# EAGLE schematic Control_Board (EAGLE 9.1.2)

## Sheet 1 of 2
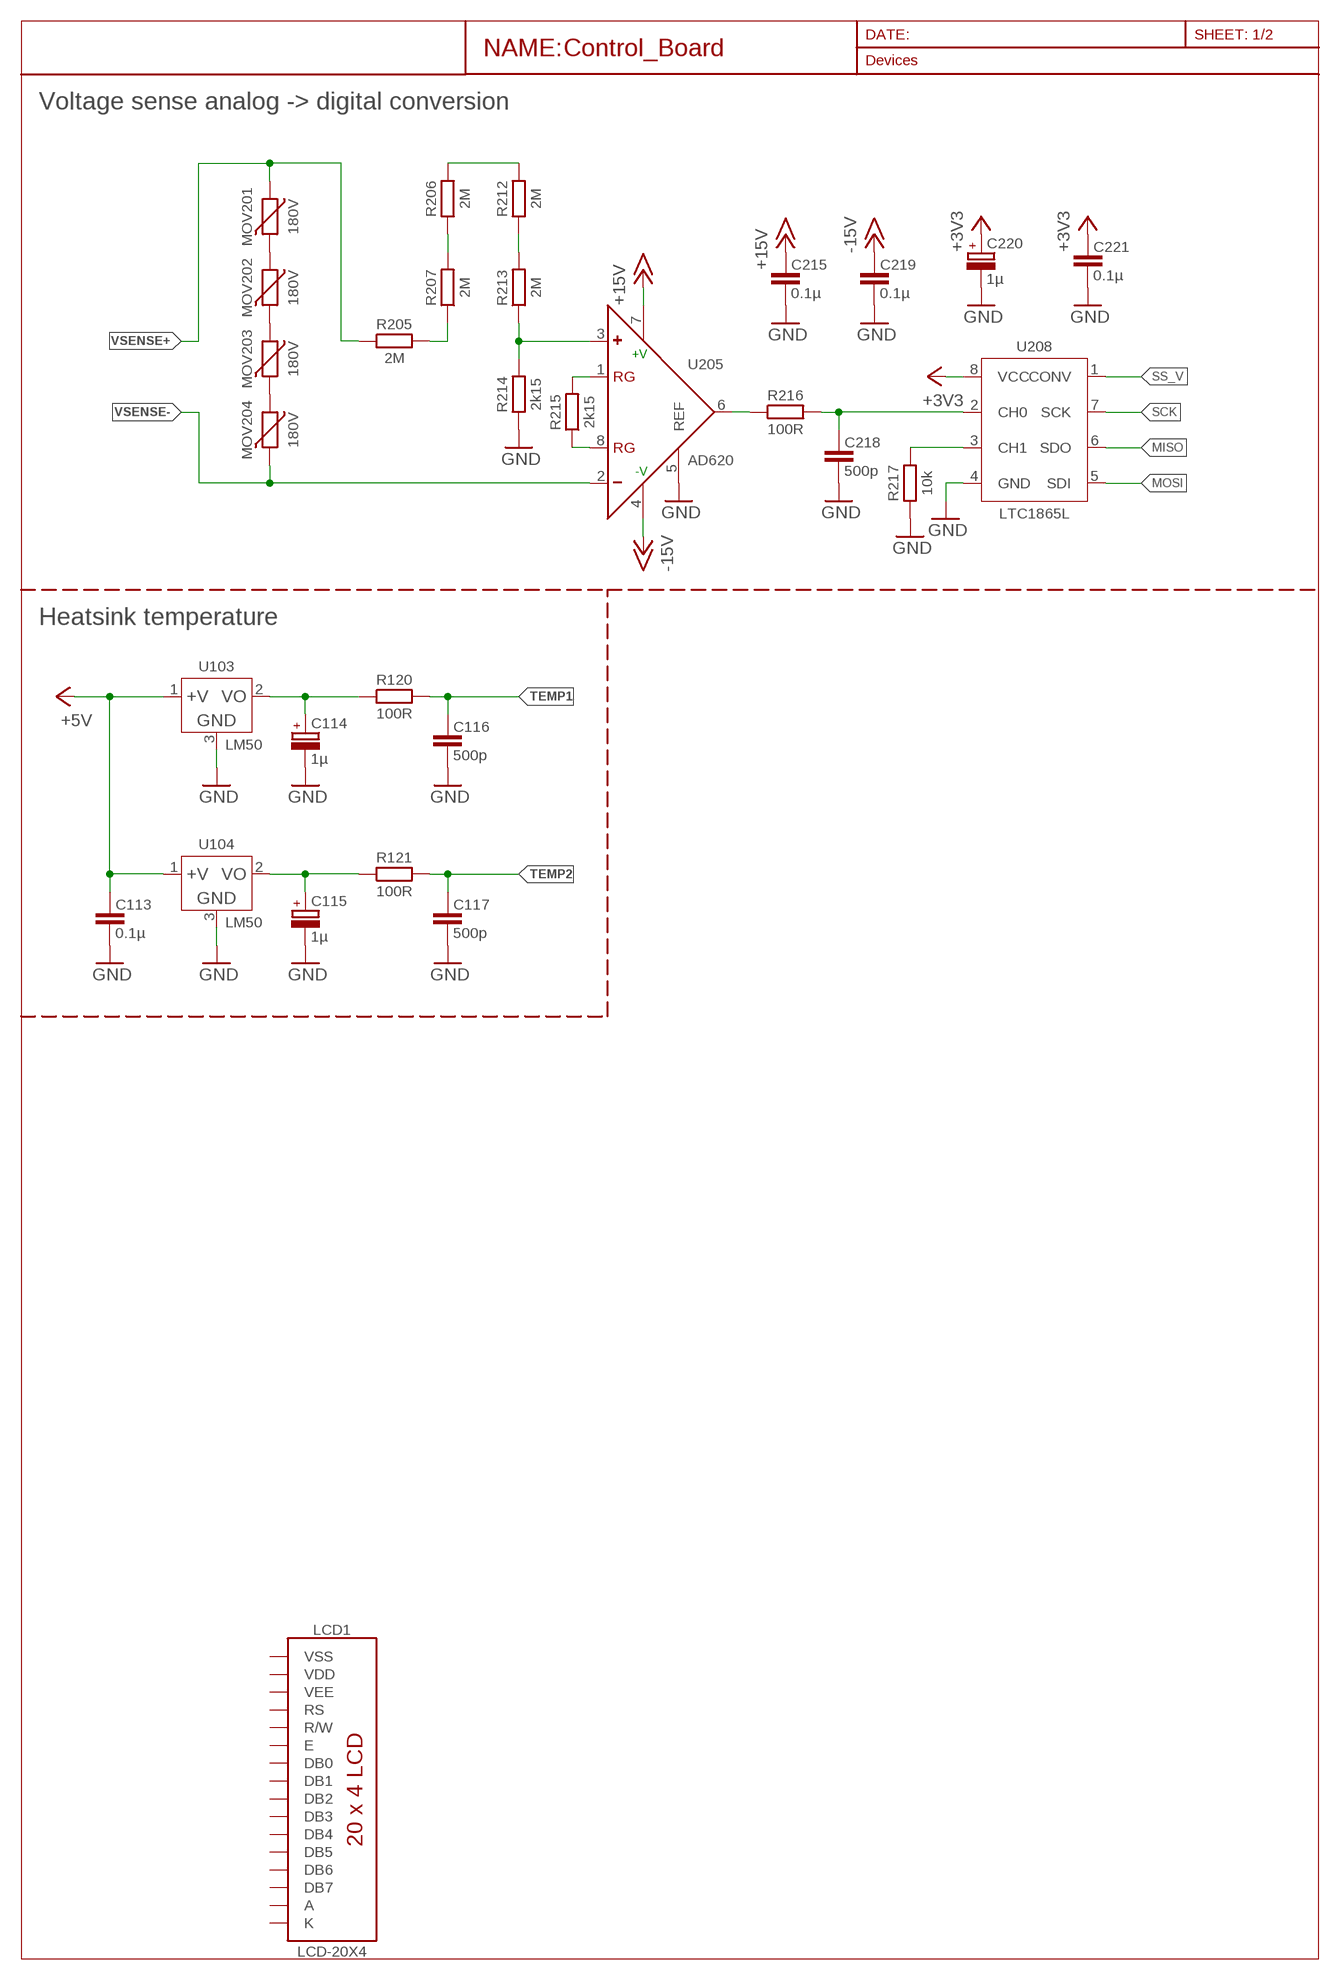
[diagram p0: schematic, sheet 1]

### Parts
C113  0.1µ  C-EU-3216  [C3216]
C114  1µ  CPOL-3216-A  [CT3216]
C115  1µ  CPOL-3216-A  [CT3216]
C116  500p  C-EU-1608  [C1608]
C117  500p  C-EU-1608  [C1608]
C215  0.1µ  C-EU-3216  [C3216]
C218  500p  C-EU-1608  [C1608]
C219  0.1µ  C-EU-3216  [C3216]
C220  1µ  CPOL-3216-A  [CT3216]
C221  0.1µ  C-EU-3216  [C3216]
LCD1  LCD-20X4  [4X20_LED]
MOV201  180V  MOV-3225  [R3225W]
MOV202  180V  MOV-3225  [R3225W]
MOV203  180V  MOV-3225  [R3225W]
MOV204  180V  MOV-3225  [R3225W]
R120  100R  R-EU-2012  [R2012W]
R121  100R  R-EU-2012  [R2012W]
R205  2M  R-EU-3216  [R3216W]
R206  2M  R-EU-3216  [R3216W]
R207  2M  R-EU-3216  [R3216W]
R212  2M  R-EU-3216  [R3216W]
R213  2M  R-EU-3216  [R3216W]
R214  2k15  R-EU-2012  [R2012W]
R215  2k15  R-EU-2012  [R2012W]
R216  100R  R-EU-2012  [R2012W]
R217  10k  R-EU-1608  [R1608]
U103  LM50  [SOT23W]
U104  LM50  [SOT23W]
U205  AD620  AD620R-8  [SO8]
U208  LTC1865L  [SO8]

### Nets
+3V3: C220.+ C221.1 U208.8(VCC) ; also sheet 2
+5V: C113.1 U103.1(+V) U104.1(+V) ; also sheet 2
+15V: C215.1 U205.7(+V) ; also sheet 2
-15V: C219.1 U205.4(-V) ; also sheet 2
GND: C113.2 C114.- C115.- C116.2 C117.2 C215.2 C218.2 C219.2 C220.- C221.2 R214.1 R217.1 U103.3(GND) U104.3(GND) U205.5(REF) U208.4(GND) ; also sheet 2
MISO: U208.6(SDO)
MOSI: U208.5(SDI)
N$1: MOV201.2 MOV202.1
N$2: MOV202.2 MOV203.1
N$25: R212.1 R213.2
N$26: R206.2 R212.2
N$27: R206.1 R207.2
N$28: R205.2 R207.1
N$29: R213.1 R214.2 U205.3(+)
N$30: C218.1 R216.2 U208.2(CH0)
N$31: R216.1 U205.6(OUT)
N$36: MOV203.2 MOV204.1
N$45: R217.2 U208.3(CH1)
RG1_H6: R215.2 U205.1(RG)
RG2_H6: R215.1 U205.8(RG)
SCK: U208.7(SCK)
SS_V: U208.1(CONV)
T1_OUT: C114.+ R120.1 U103.2(VO)
T2_OUT: C115.+ R121.1 U104.2(VO)
TEMP1: C116.1 R120.2
TEMP2: C117.1 R121.2
VSENSE+: MOV201.1 R205.1
VSENSE-: MOV204.2 U205.2(-)
Unconnected: LCD1.4(RS) LCD1.5(R/W) LCD1.6(E) LCD1.7(DB0) LCD1.8(DB1) LCD1.9(DB2) LCD1.10(DB3) LCD1.11(DB4) LCD1.12(DB5) LCD1.13(DB6) LCD1.14(DB7)

### Notes on the sheet
- Voltage sense analog -> digital conversion
- Heatsink temperature

## Sheet 2 of 2
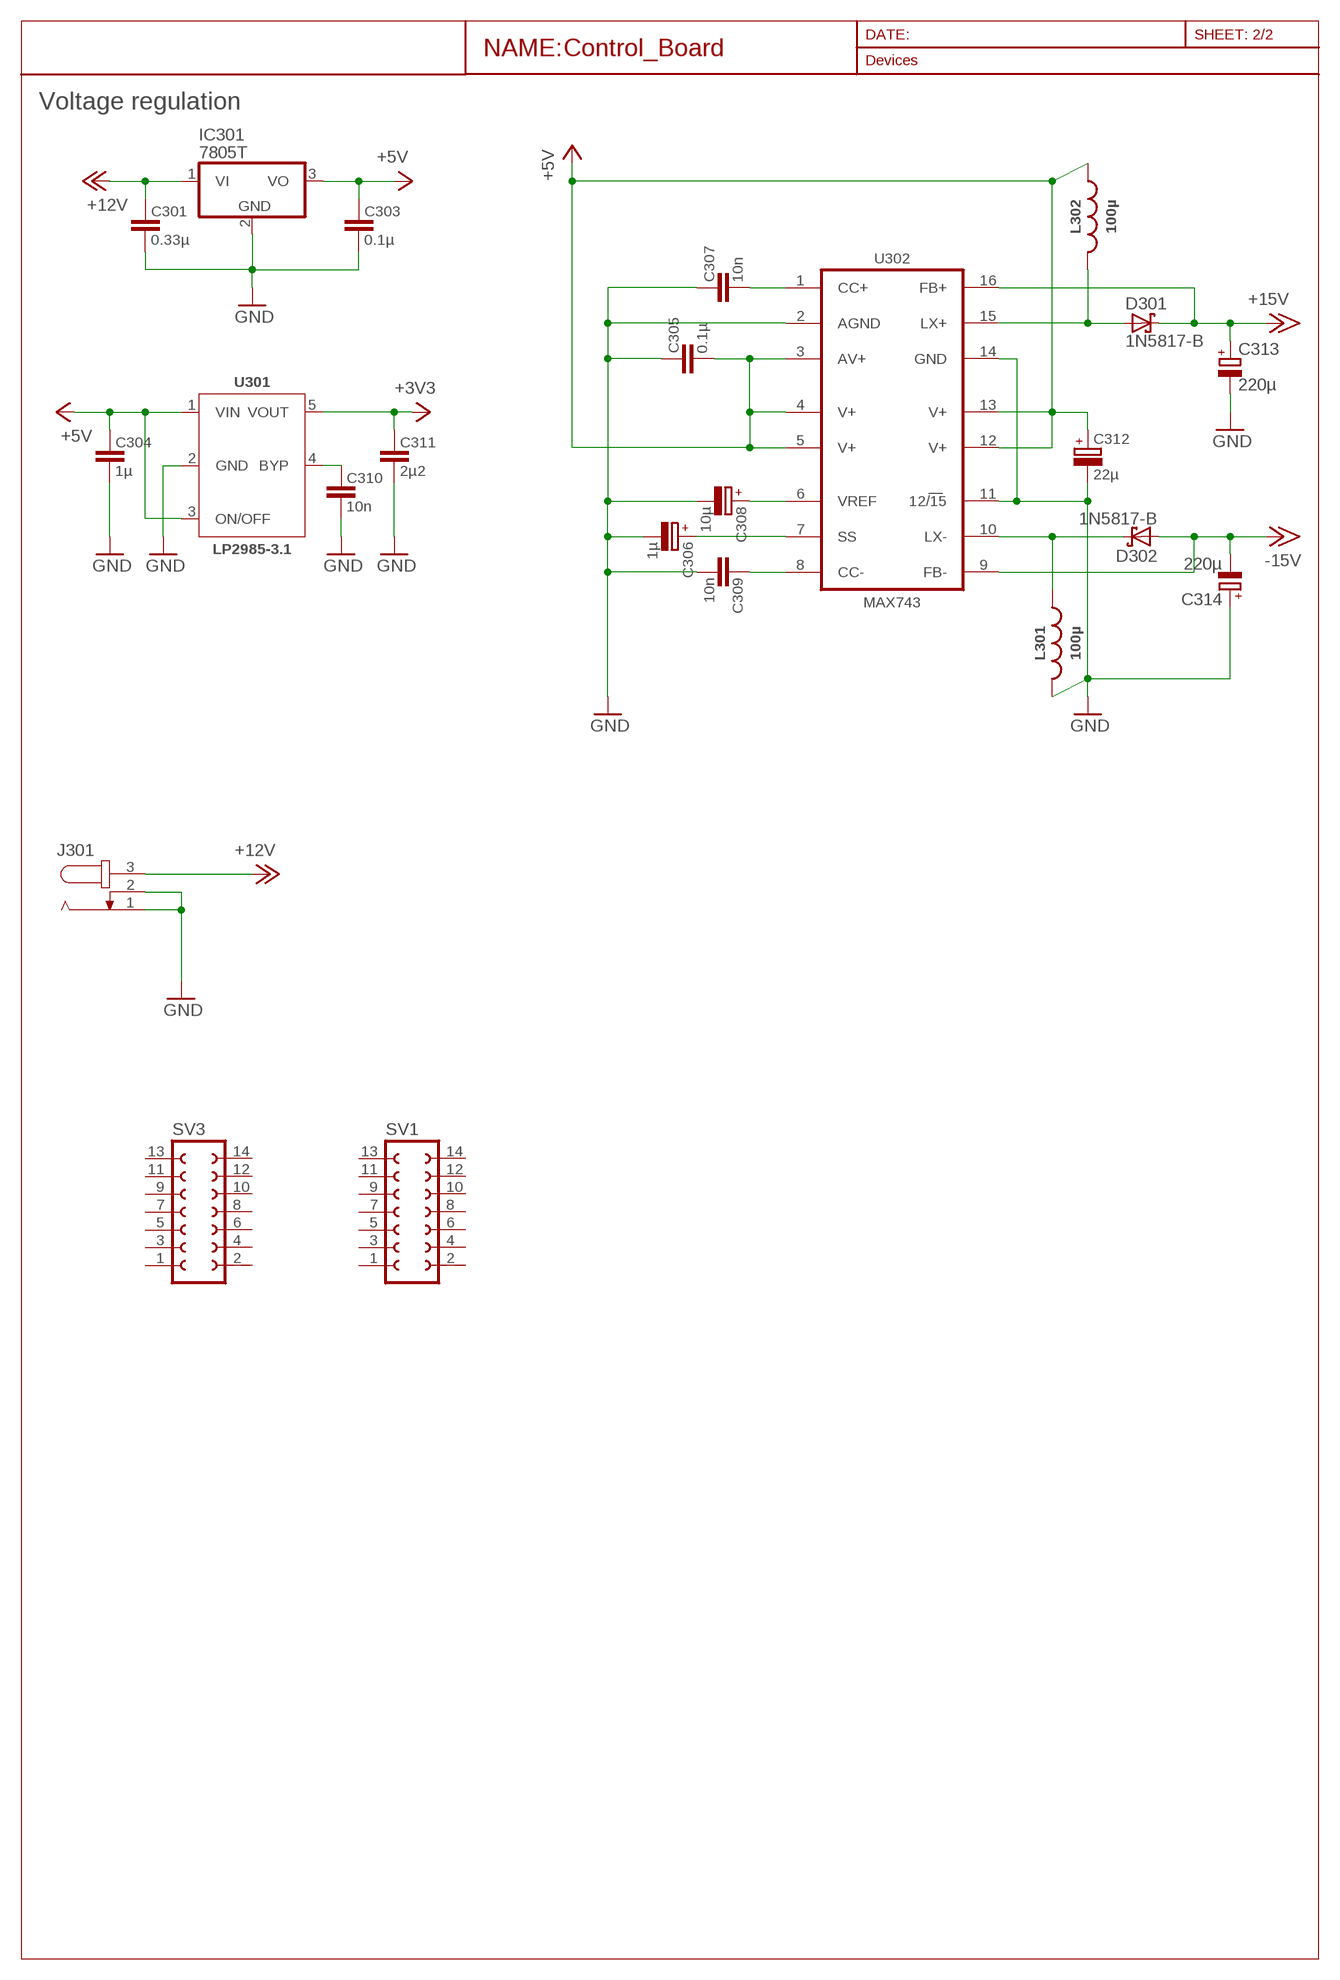
[diagram p1: schematic, sheet 2]

### Parts
C301  0.33µ  C-EU-3216  [C3216]
C303  0.1µ  C-EU-3216  [C3216]
C304  1µ  C-EU-3216  [C3216]
C305  0.1µ  C-EU-3216  [C3216]
C306  1µ  CPOL-3216-A  [CT3216]
C307  10n  C-EU-3216  [C3216]
C308  10µ  CPOL-6032-C  [CT6032]
C309  10n  C-EU-3216  [C3216]
C310  10n  C-EU-3216  [C3216]
C311  2µ2  C-EU-3216  [C3216]
C312  22µ  CPOL-6032-C  [CT6032]
C313  220µ  CPOL-EUE3.5-10  [E3,5-10]
C314  220µ  CPOL-EUE3.5-10  [E3,5-10]
D301  1N5817-B  [DO41-7.6]
D302  1N5817-B  [DO41-7.6]
IC301  7805T  [TO220H]
J301  JACK-PLUG0  [SPC4077]
L301  100µ  L-EUSRN1060  [SRN1060]
L302  100µ  L-EUSRN1060  [SRN1060]
SV1  FE07-2W  [FE07-2W]
SV3  FE07-2W  [FE07-2W]
U301  LP2985-3.1  [SOT23-5L]
U302  MAX743  MAX743WE  [SO16W]

### Nets
+3V3: C311.1 U301.5(VOUT) ; also sheet 1
+5V: C303.1 C304.1 C305.2 C312.+ IC301.3(VO) L302.1 U301.1(VIN) U301.3(ON/OFF) U302.3(AV+) U302.4(V+) U302.5(V+) U302.12(V+) U302.13(V+) ; also sheet 1
+12V: C301.1 IC301.1(VI) J301.3
+15V: C313.+ D301.C U302.16(FB+) ; also sheet 1
-15V: C314.- D302.A U302.9(FB-) ; also sheet 1
GND: C301.2 C303.2 C304.2 C305.1 C306.- C307.1 C308.- C309.2 C310.2 C311.2 C312.- C313.- C314.+ IC301.2(GND) J301.1 J301.2 L301.2 U301.2(GND) U302.2(AGND) U302.11(12/15) U302.14(GND) ; also sheet 1
N$10: C310.1 U301.4(BYP)
N$32: C309.1 U302.8(CC-)
N$33: C306.+ U302.7(SS)
N$34: C307.2 U302.1(CC+)
N$35: D301.A L302.2 U302.15(LX+)
N$41: D302.C L301.1 U302.10(LX-)
VREF2: C308.+ U302.6(VREF)
Unconnected: SV1.1 SV1.2 SV1.3 SV1.4 SV1.5 SV1.6 SV1.7 SV1.8 SV1.9 SV1.10 SV1.11 SV1.12 SV1.13 SV1.14 SV3.1 SV3.2 SV3.3 SV3.4 SV3.5 SV3.6 SV3.7 SV3.8 SV3.9 SV3.10 SV3.11 SV3.12 SV3.13 SV3.14

### Notes on the sheet
- Voltage regulation

## Power pins joined to a net without a drawn wire
A: LCD1.15(A)
K: LCD1.16(K)
VDD: LCD1.2(VDD)
VEE: LCD1.3(VEE)
VSS: LCD1.1(VSS)

## Library data of the parts
C113 C116 C117 C215 C218 C219 C221 C301 C303-C305 C307 C309-C311 = passives:C-EU
C114 C115 C220 C306 C308 C312 = passives:CPOL
C313 C314 = rcl:CPOL-EU: POLARIZED CAPACITOR, European symbol; SPICEPREFIX: C
D301 D302 = diode:1N581*: 1.0A SCHOTTKY BARRIER RECTIFIER Source: http://www.diodes.com/datasheets/ds23001.pdf
IC301 = linear:78*: Positive VOLTAGE REGULATOR Source: http://cache.national.com/ds/LM/LM78L05.pdf http://www.fairchildsemi.com/ds/LM/LM7805.pdf
J301 = con-jack:JACK-PLUG: DC POWER JACK Power Jack, DC, Right Angle, Through Hole, Rated 5A at 16VDC, PC Terminals Distributor: Farnell (www.Farnell.de) Drawing: 84N1161.pdf / 84N1162.pdf Manufacturer: SPC Technology (www.spctechnology.com) Type: SPC4077 / SPC 4078; OC_FARNELL: unknown; OC_NEWARK: unknown
L301 L302 = passives:L-EU
LCD1 = mechanical:LCD-20X4
MOV201-MOV204 = passives:MOV
R120 R121 R205-R207 R212-R217 = passives:R-EU
SV1 SV3 = con-lsta:FE07-2W: FEMALE HEADER; OC_FARNELL: unknown; OC_NEWARK: unknown
U103 U104 = ic:LM50
U205 = ic:AD620
U208 = ic:LTC1865L: The LTC®1864L/LTC1865L are 16-bit A/D converters that are offered in MSOP and SO-8 packages and operate on a single 3V supply. At 150ksps, the supply current is only 450µA. The supply current drops at lower speeds because the LTC1864L/LTC1865L automatically power down between conversions. These 16-bit switched capacitor successive approximation ADCs include sample-and-holds. The LTC1864L has a differential analog input with an external reference pin. The LTC1865L offers a softwareselectable 2-channel MUX and an external reference pin on the MSOP version. The 3-wire, serial I/O, small MSOP or SO-8 package and extremely high sample rate-to-power ratio make these ADCs ideal choices for compact, low power, high speed systems
U301 = ic:LP2985
U302 = ic:MAX743

## Net classes
0 default: width 0.203 mm, drill 0.3 mm, clearance 0.203 mm